# Altium schematic sheet RLS.SchDoc: RLS
size OrCAD A; ApprovedBy: Abbas Mahmoud; CheckedBy: Abbas Mahmoud; Author: Abbas Mahmoud; CompanyName: lsa 4wya :); DrawnBy: Abbas Mahmoud; Engineer: Abbas Mahmoud; DocumentNumber: 6; Revision: 1; SheetNumber: 6; SheetTotal: 8
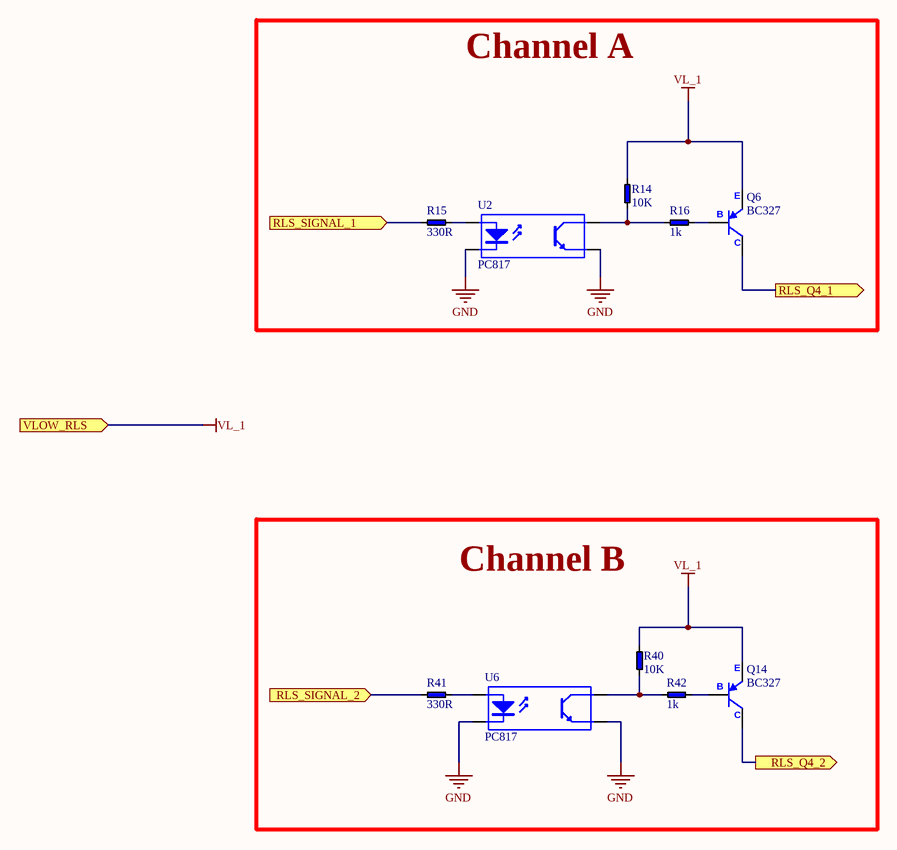
[diagram p0: RLS.SchDoc]

## Parts
Q6  BC327  [Transistor - duplicate3]
Q14  BC327  [Transistor - duplicate3]
R14  10K  [RESISTOR _9]
R15  330R  [RESISTOR _9]
R16  1k  [RESISTOR _9]
R40  10K  [RESISTOR _9]
R41  330R  [RESISTOR _9]
R42  1k  [RESISTOR _9]
U2  PC817  [IC X4 PIN]
U6  PC817  [IC X4 PIN]

## Blocks framed on the sheet
Channel A: Q6 R14-R16 U2
Channel B: Q14 R40-R42 U6

## Ports
RLS_Q4_1 (out), RLS_Q4_2 (out), RLS_SIGNAL_1 (in), RLS_SIGNAL_2 (in), VLOW_RLS (in)

## Nets
GND: U2.2(K) U2.3(E) U6.2(K) U6.3(E)
VL_1: Q6.1(E) Q14.1(E) R14.2 R40.2 ; port VLOW_RLS
RLS_Q4_1: Q6.3(C) ; port RLS_Q4_1
RLS_Q4_2: Q14.3(C) ; port RLS_Q4_2
RLS_SIGNAL_1: R15.1 ; port RLS_SIGNAL_1
RLS_SIGNAL_2: R41.1 ; port RLS_SIGNAL_2
NetQ6_2: Q6.2(B) R16.2
NetQ14_2: Q14.2(B) R42.2
NetR14_1: R14.1 R16.1 U2.4(C)
NetR15_2: R15.2 U2.1(A)
NetR40_1: R40.1 R42.1 U6.4(C)
NetR41_2: R41.2 U6.1(A)

## Notes on the sheet
- Title
- Size:
- Date:
- Orcad A
- Number:
- Time:
- Revision:
- Sheet
- of
- File:

## Library data of the parts
Q6 Q14 = PNP
R14-R16 R40-R42 = RESISTOR
U2 U6 = Opto-coupler: 4-Pin Phototransistor Optocoupler; Published: 24-Mar-1999; LatestRevisionDate: 04-Mar-2005; LatestRevisionNote: Sch pins 3 & 4 Swapped.; DatasheetVersion: Nov-2003; PackageReference: DIP-4; Publisher: Altium Limited